# EasyEDA schematic SCH_2022-09-02.json
TITLE: 嘉立创EDA季开放21009101425; REV: 1.0; Date: 2022-08-30; Sheet: 1/1; Company: XDU
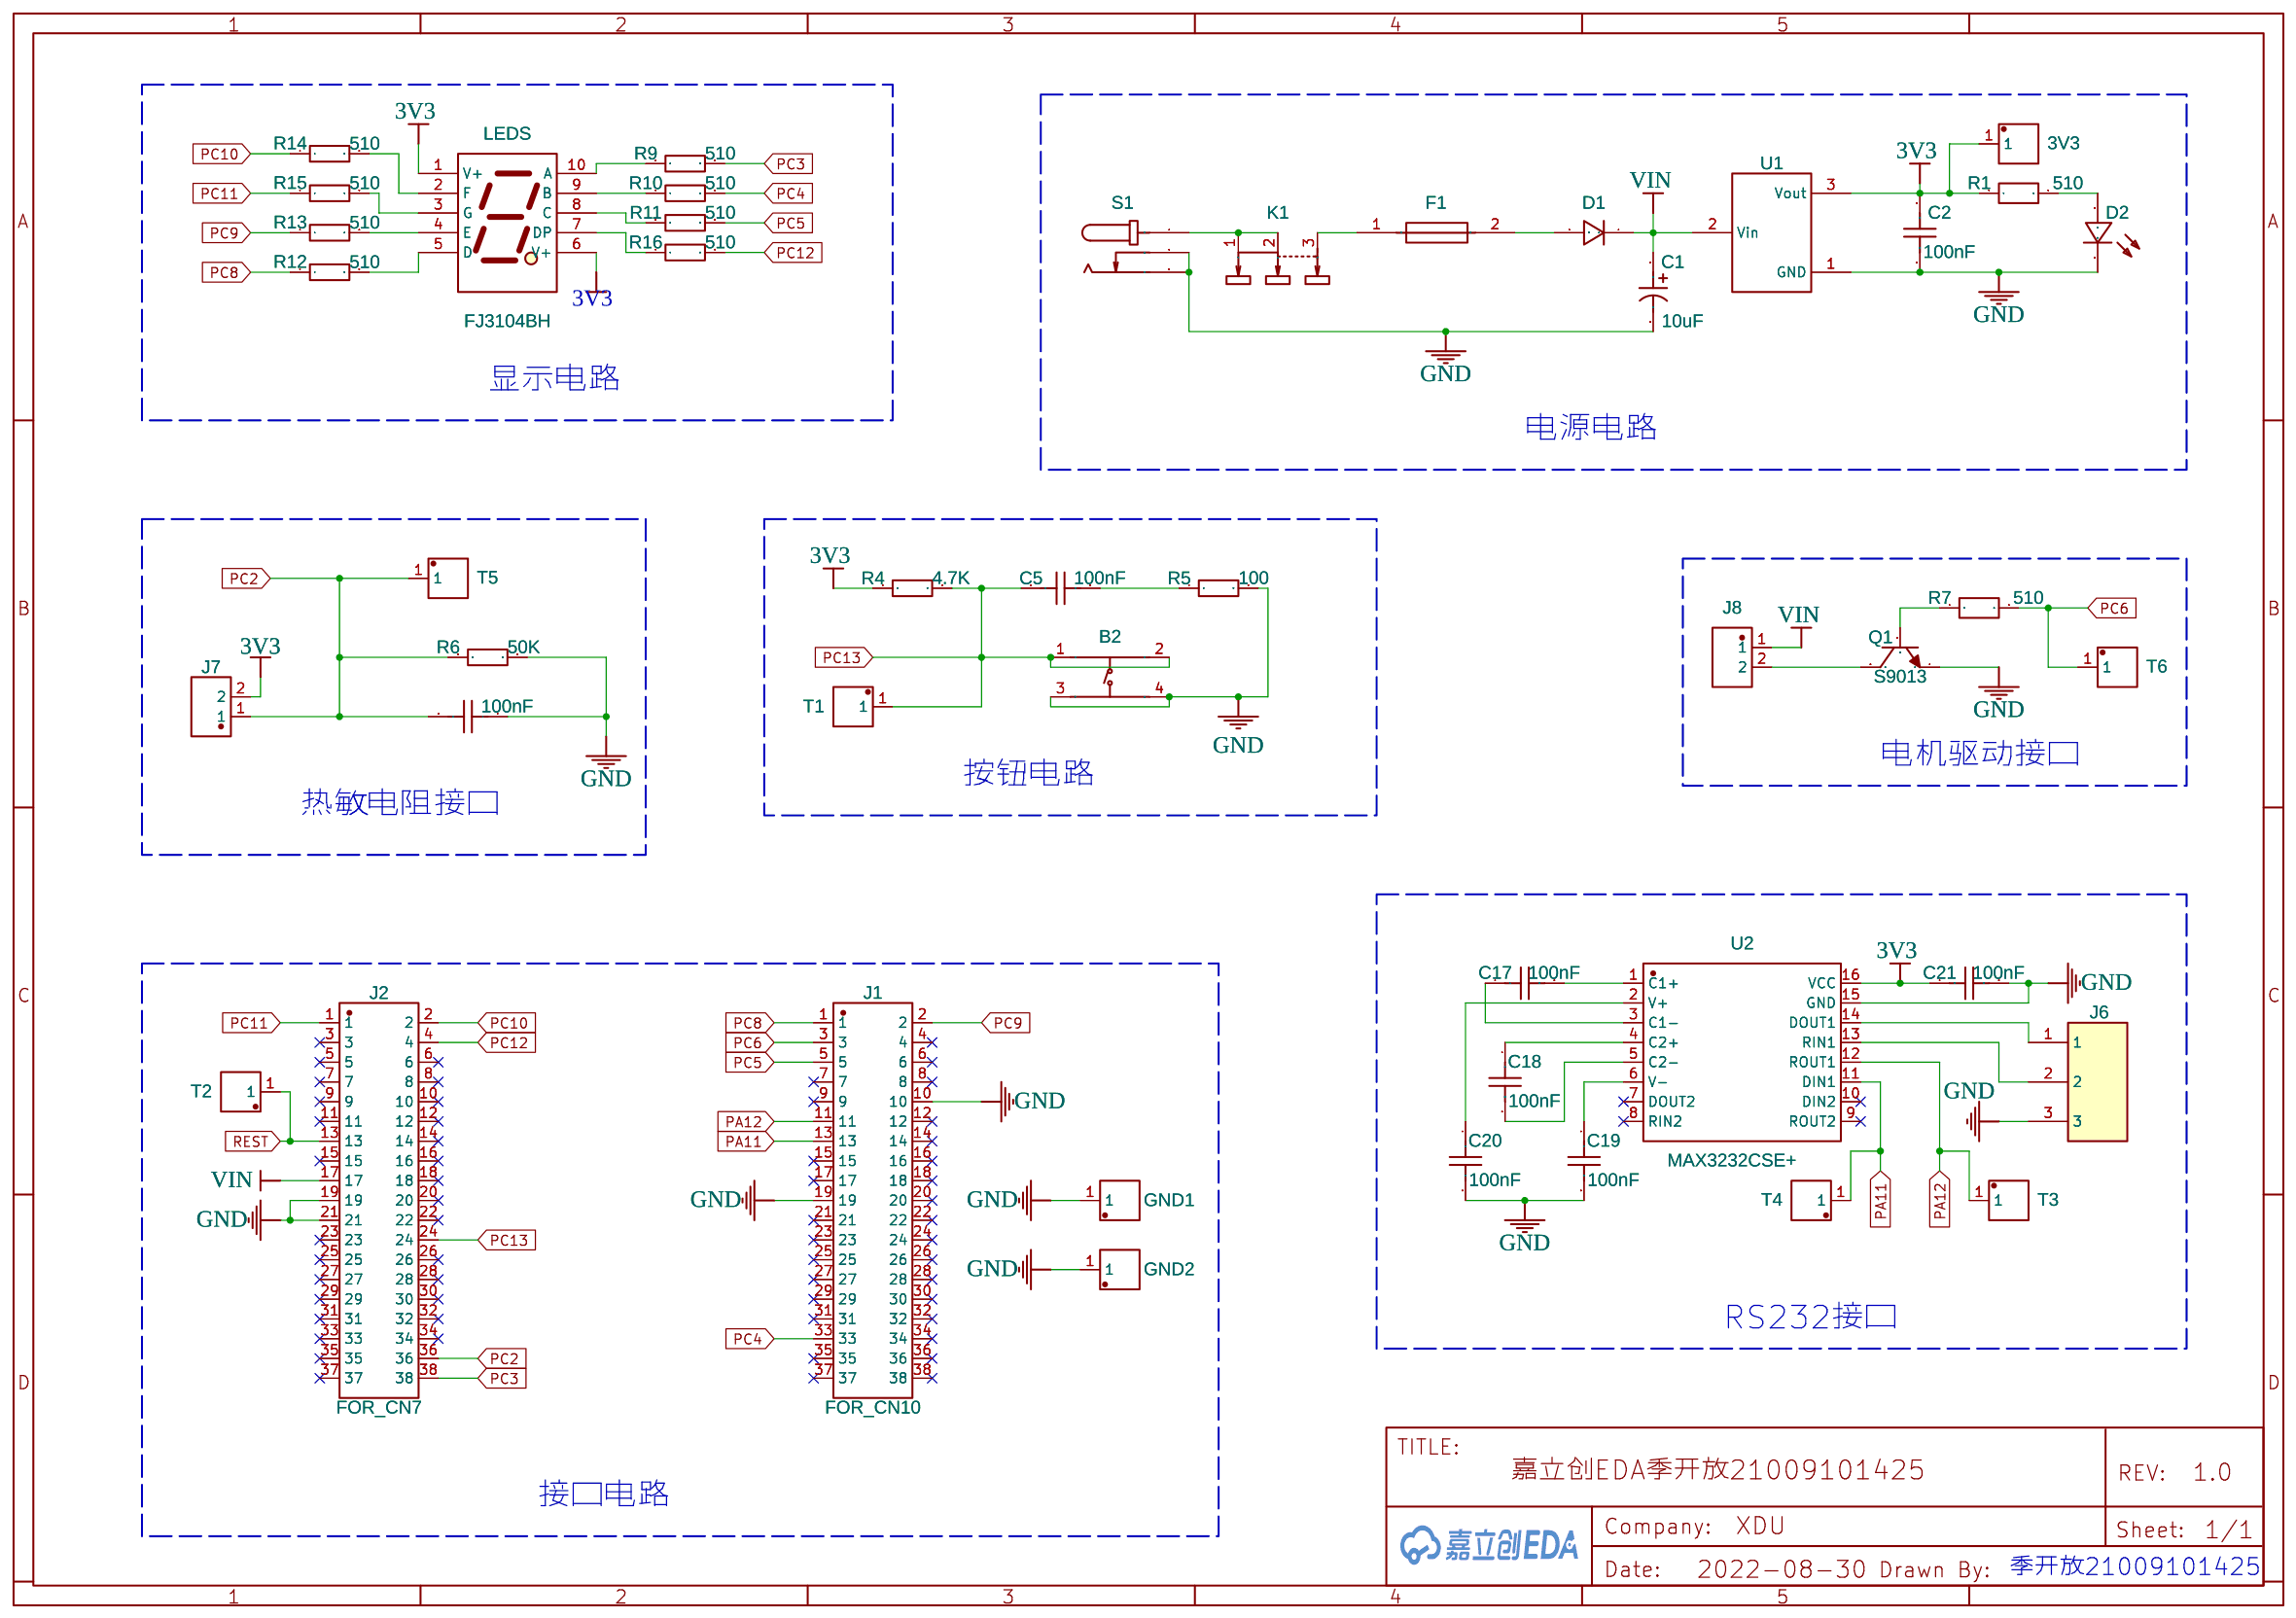
[diagram p0: schematic sheet]

## Parts
3V3  54101-T06-00  [HDR-TH_1P-P2.54-V-M]
B2  TS665CJ  [SW-TH_4P-L6.0-W6.0-P4.50-LS6.5]
C1  10uF  [CAP-TH_BD5.0-P2.00-D0.6-FD]
C2  100nF  [CAP-TH_L5.5-W2.5-P5.00-D1.0]
C3  100nF  [CAP-TH_L5.5-W2.5-P5.00-D1.0]
C5  100nF  [CAP-TH_L5.5-W2.5-P5.00-D1.0]
C17  100nF  [CAP-TH_L5.5-W2.5-P5.00-D1.0]
C18  100nF  [CAP-TH_L5.5-W2.5-P5.00-D1.0]
C19  100nF  [CAP-TH_L5.5-W2.5-P5.00-D1.0]
C20  100nF  [CAP-TH_L5.5-W2.5-P5.00-D1.0]
C21  100nF  [CAP-TH_L5.5-W2.5-P5.00-D1.0]
D1  1N5817_C169165  [DO-41_BD2.4-L4.7-P8.70-D0.9-RD]
D2  TJ-L3FYTGHTFCLFLC2R-A5  [LED-TH_BD3.9-P2.54-FD]
F1  A72-065  [FUSE-TH_L9.7-W3.1-P5.10-D0.6-S1.50]
GND1  54101-T06-00  [HDR-TH_1P-P2.54-V-M]
GND2  54101-T06-00  [HDR-TH_1P-P2.54-V-M]
J1  FOR_CN10  [HDR-TH_38P-P2.54-V-F-R2-C19-S2.54]
J2  FOR_CN7  [HDR-TH_38P-P2.54-V-F-R2-C19-S2.54]
J6  WJ124-3.81-3P  [CONN-TH_3P-P3.81_WJ124-3.81-3P]
J7  WJ124-3.81-2P  [CONN-TH_2P-P3.81_KF124-3.81-2P]
J8  WJ124-3.81-2P  [CONN-TH_2P-P3.81_KF124-3.81-2P]
K1  SS-12D10L5  [SW-TH_SS-12D10L5]
LEDS  FJ3104BH  [LED-SEG-TH_10P-L12.7-W7.6-P2.54-LS5.08-TL]
Q1  S9013  [TO-92-3_L4.9-W3.7-P1.27-L]
R1  510  [RES-TH_BD1.8-L3.2-P7.20-D0.4]
R4  4.7K  [RES-TH_BD1.8-L3.2-P7.20-D0.4]
R5  100  [RES-TH_BD1.8-L3.2-P7.20-D0.4]
R6  50K  [RES-TH_BD1.8-L3.2-P7.20-D0.4]
R7  510  [RES-TH_BD1.8-L3.2-P7.20-D0.4]
R9  510  [RES-TH_BD1.8-L3.2-P7.20-D0.4]
R10  510  [RES-TH_BD1.8-L3.2-P7.20-D0.4]
R11  510  [RES-TH_BD1.8-L3.2-P7.20-D0.4]
R12  510  [RES-TH_BD1.8-L3.2-P7.20-D0.4]
R13  510  [RES-TH_BD1.8-L3.2-P7.20-D0.4]
R14  510  [RES-TH_BD1.8-L3.2-P7.20-D0.4]
R15  510  [RES-TH_BD1.8-L3.2-P7.20-D0.4]
R16  510  [RES-TH_BD1.8-L3.2-P7.20-D0.4]
S1  JPD1030-N521-4F  [DC-IN-TH_JPD1030-N521-4F]
T1  54101-T06-00  [HDR-TH_1P-P2.54-V-M]
T2  54101-T06-00  [HDR-TH_1P-P2.54-V-M]
T3  54101-T06-00  [HDR-TH_1P-P2.54-V-M]
T4  54101-T06-00  [HDR-TH_1P-P2.54-V-M]
T5  54101-T06-00  [HDR-TH_1P-P2.54-V-M]
T6  54101-T06-00  [HDR-TH_1P-P2.54-V-M]
U1  HT7533-1_C32617  [TO-92-3_L4.9-W3.7-P1.27-L]
U2  MAX3232CSE+  [SO-16_L10.0-W4.0-P1.27-LS6.2-BL]

## Library data of the parts
3V3 GND1 GND2 T1-T6 = 54101-T06-00: Supplier: LCSC; Supplier Part: C213463; Manufacturer: Amphenol ICC; Contributor: LCSC; JLCPCB Part Class: Extended Part
B2 = TS665CJ: Supplier: LCSC; Supplier Part: C393938; Manufacturer: SHOU HAN; Contributor: LCSC; JLCPCB Part Class: Extended Part
C1 = 50V10UF CD110: Supplier: LCSC; Supplier Part: C2960200; Manufacturer: HRK(鸿瑞凯电子); Manufacturer Part: 50V10uF CD110; JLCPCB Part Class: Extended Part; Contributor: lcsc
C2 C3 C5 C17-C21 = CT4-0805B104K500F3: Supplier: LCSC; Manufacturer: FH; Contributor: LCSC; Supplier Part: C84772; JLCPCB Part Class: Extended Part
D1 = 1N5817_C169165: Supplier Part: C169165; Supplier: LCSC; Manufacturer: DIOFIT; Manufacturer Part: 1N5817; Contributor: LCSC; JLCPCB Part Class: Extended Part
D2 = TJ-L3FYTGHTFCLFLC2R-A5: Supplier: LCSC; Supplier Part: C330746; Manufacturer: TOGIALED; Contributor: LCSC; JLCPCB Part Class: Extended Part
F1 = A72-065: Supplier: LCSC; Manufacturer: JDTFUSE; Contributor: LCSC; Supplier Part: C135426; JLCPCB Part Class: Extended Part
J1 J2 = PM254-2-19-Z-8.5: Supplier: LCSC; Supplier Part: C2897420; Manufacturer: HCTL(华灿天禄); Contributor: LCSC; JLCPCB Part Class: Extended Part
J6 = WJ124-3.81-3P: Supplier: LCSC; Manufacturer: ReliaPro; Supplier Part: C36780; JLCPCB Part Class: Extended Part
J7 J8 = WJ124-3.81-2P: Supplier: LCSC; Manufacturer: ReliaPro; Supplier Part: C69811; JLCPCB Part Class: Extended Part
K1 = SS-12D10L5: Supplier: LCSC; Supplier Part: C319012; Manufacturer: XKB Enterprise; Contributor: LCSC; JLCPCB Part Class: Extended Part
LEDS = FJ3104BH: Supplier: LCSC; Supplier Part: C2938319; Manufacturer: 志浩; Contributor: LCSC
Q1 = S9013: Supplier: LCSC; Manufacturer: CJ; Supplier Part: C6748; JLCPCB Part Class: Extended Part
R1 = MF1/8W-10KΩ±1%T52: Supplier: LCSC; Supplier Part: C713919; Manufacturer: Huaxing Mechanical-Elec.; Contributor: LCSC; JLCPCB Part Class: Extended Part; Resistance: 510Ω
R4 = MF1/8W-43Ω±1% T52: Supplier: LCSC; Supplier Part: C119149; Manufacturer: Chian Chia Elec; Contributor: LCSC; JLCPCB Part Class: Extended Part; Resistance: 4.7kΩ
R5 = MF1/8W-43Ω±1% T52: Supplier: LCSC; Supplier Part: C119149; Manufacturer: Chian Chia Elec; Contributor: LCSC; JLCPCB Part Class: Extended Part; Resistance: 100Ω
R6 = MF1/8W-43Ω±1% T52: Supplier: LCSC; Supplier Part: C119149; Manufacturer: Chian Chia Elec; Contributor: LCSC; JLCPCB Part Class: Extended Part; Resistance: 50kΩ
R7 = MF1/8W-10KΩ±1%T52: Supplier: LCSC; Supplier Part: C713919; Manufacturer: Huaxing Mechanical-Elec.; Contributor: LCSC; JLCPCB Part Class: Extended Part; Resistance: 10kΩ
R9-R16 = MF1/8W-43Ω±1% T52: Supplier: LCSC; Supplier Part: C119149; Manufacturer: Chian Chia Elec; Contributor: LCSC; JLCPCB Part Class: Extended Part; Resistance: 510Ω
S1 = JPD1030-N521-4F: Supplier: LCSC; Supplier Part: C426213; Manufacturer: FOXCONN(富士康); Contributor: LCSC; JLCPCB Part Class: Extended Part
U1 = HT7533-1_C32617: Supplier: LCSC; Manufacturer: HOLTEK; Manufacturer Part: HT7533-1; Supplier Part: C32617; JLCPCB Part Class: Extended Part
U2 = MAX3232CSE+: Supplier: LCSC; Supplier Part: C143430; Manufacturer: Maxim Integrated; Contributor: LCSC; JLCPCB Part Class: Extended Part

## Nets
3V3: 3V3.1 C2.1 C21.1 J7.2 LEDS.1(V+) LEDS.6(V+) R1.1 R4.1 U1.3(Vout) U2.16(VCC)
GND: B2.3(C) B2.4(D) C1.2 C2.2 C3.1 C19.2 C20.2 C21.2 D2.2 GND1.1 GND2.1 J1.10 J1.19 J2.19 J2.21 J6.3 Q1.1(E) R5.2 R6.2 S1.2 S1.3 U1.1(GND) U2.15(GND)
VIN: C1.1 D1.1 J2.17 J8.1 U1.2(Vin)
PA11: J1.13 T4.1 U2.11(DIN1)
PA12: J1.11 T3.1 U2.12(ROUT1)
PC2: C3.2 J2.36 J7.1 R6.1 T5.1
PC3: J2.38 R9.2
PC4: J1.33 R10.2
PC5: J1.5 R11.2
PC6: J1.3 R7.2 T6.1
PC8: J1.1 R12.1
PC9: J1.2 R13.1
PC10: J2.2 R14.1
PC11: J2.1 R15.1
PC12: J2.4 R16.2
PC13: B2.1(A) B2.2(B) C5.2 J2.24 R4.2 T1.1
REST: J2.13 T2.1
Net-(C5-1): C5.1 R5.1
Net-(C17-1): C17.1 U2.3(C1-)
Net-(C17-2): C17.2 U2.1(C1+)
Net-(C18-1): C18.1 U2.4(C2+)
Net-(C18-2): C18.2 U2.5(C2-)
Net-(C19-1): C19.1 U2.6(V-)
Net-(C20-1): C20.1 U2.2(V+)
Net-(D1-2): D1.2 F1.2
Net-(D2-1): D2.1 R1.2
Net-(F1-1): F1.1 K1.3
Net-(J6-1): J6.1 U2.14(DOUT1)
Net-(J6-2): J6.2 U2.13(RIN1)
Net-(J8-2): J8.2 Q1.3(C)
Net-(K1-1): K1.1 K1.2 S1.1
Net-(LEDS-2): LEDS.2(F) R14.2
Net-(LEDS-3): LEDS.3(G) R15.2
Net-(LEDS-4): LEDS.4(E) R13.2
Net-(LEDS-5): LEDS.5(D) R12.2
Net-(LEDS-7): LEDS.7(DP) R16.1
Net-(LEDS-8): LEDS.8(C) R11.1
Net-(LEDS-9): LEDS.9(B) R10.1
Net-(LEDS-10): LEDS.10(A) R9.1
Net-(Q1-2): Q1.2(B) R7.1

Not connected (* = marked no-connect by the designer): J1 4* 6* 7* 8* 9* 12* 14* 15* 16* 17* 18* 20* 21* 22* 23* 24* 25* 26* 27* 28* 29* 30* 31* 32* 34* 35* 36* 37* 38*; J2 3* 5* 6* 7* 8* 9* 10* 11* 12* 14* 15* 16* 18* 20* 22* 23* 25* 26* 27* 28* 29* 30* 31* 32* 33* 34* 35* 37*; U2 7(DOUT2)* 8(RIN2)* 9(ROUT2)* 10(DIN2)*

## Notes on the sheet
- 显示电路
- 电源电路
- 电机驱动接口
- 按钮电路
- 热敏电阻接口
- RS232接口
- 接口电路
- 季开放21009101425
